# EAGLE schematic my version (EAGLE 6.4)
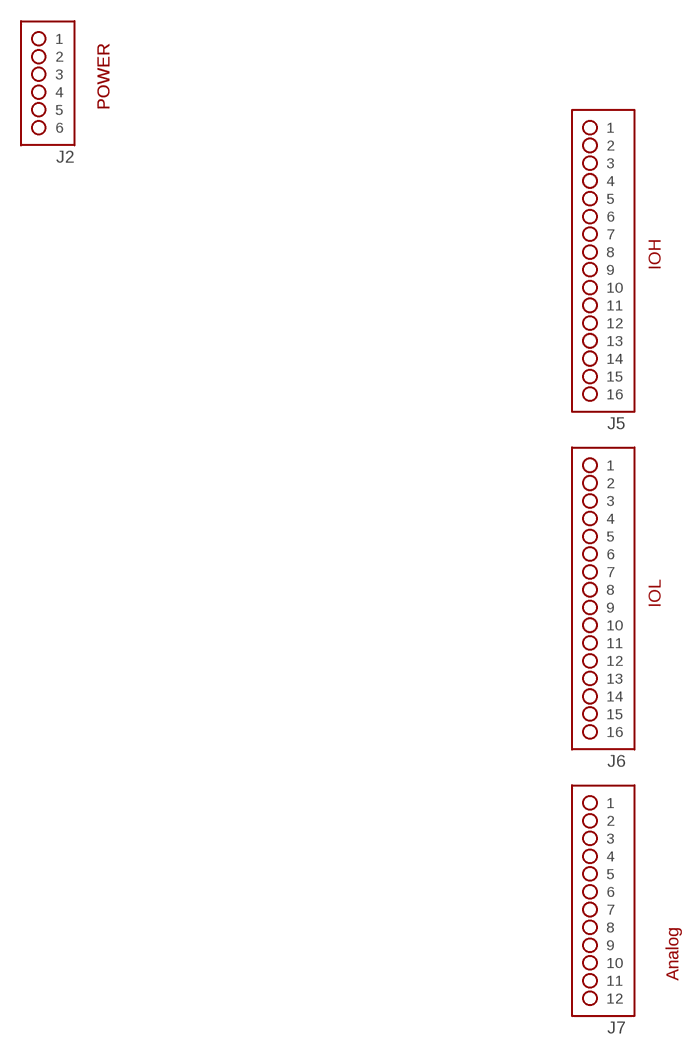
[diagram p0: schematic, sheet 1]

## Parts
J2  HDR-1X6  [HDR-1X6]
J5  HDR-2X8  [HDR-2X8]
J6  HDR-2X8  [HDR-2X8]
J7  HDR-2X6  [HDR-2X6]
Unconnected: J2.1 J2.2 J2.3 J2.4 J2.5 J2.6 J5.1 J5.2 J5.3 J5.4 J5.5 J5.6 J5.7 J5.8 J5.9 J5.10 J5.11 J5.12 J5.13 J5.14 J5.15 J5.16 J6.1 J6.2 J6.3 J6.4 J6.5 J6.6 J6.7 J6.8 J6.9 J6.10 J6.11 J6.12 J6.13 J6.14 J6.15 J6.16 J7.1 J7.2 J7.3 J7.4 J7.5 J7.6 J7.7 J7.8 J7.9 J7.10 J7.11 J7.12

## Notes on the sheet
- POWER | POWER
- IOH
- IOL
- Analog

## Library data of the parts
J2 = Mechanical:HDR-1X6
J5 J6 = Mechanical:HDR-2X8: 100mil 2x8 header
J7 = Mechanical:HDR-2X6: 2x6 header with 42mil holes and 100mil spacing